# Altium schematic sheet 如意硬件采集模块0831.SchDoc
size A2
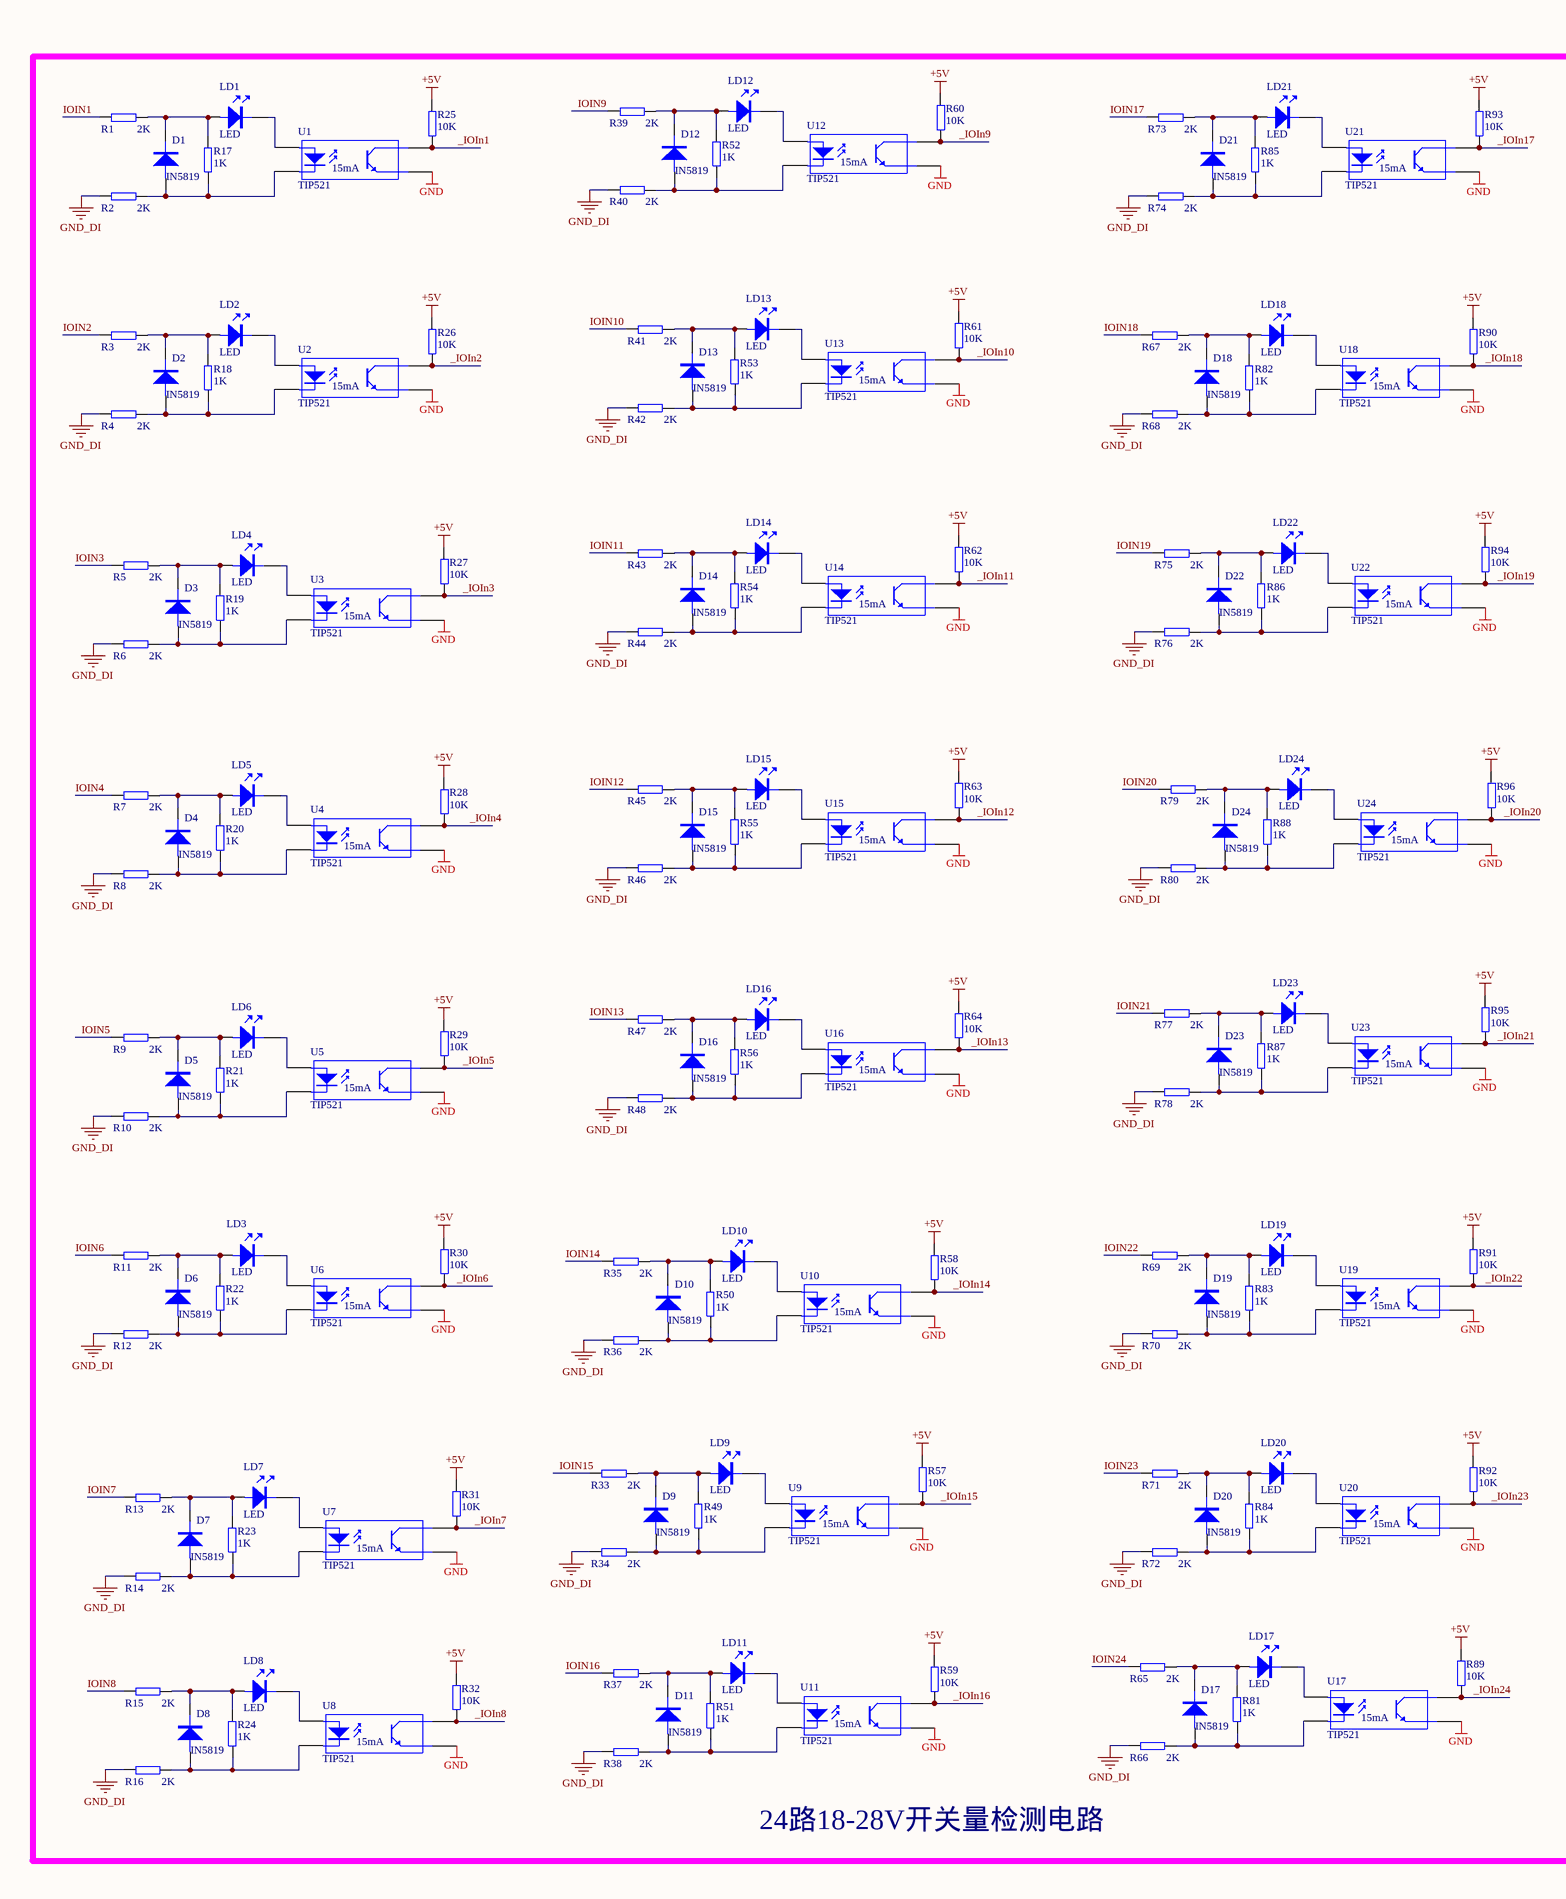
[diagram p0: 如意硬件采集模块0831.SchDoc, left]
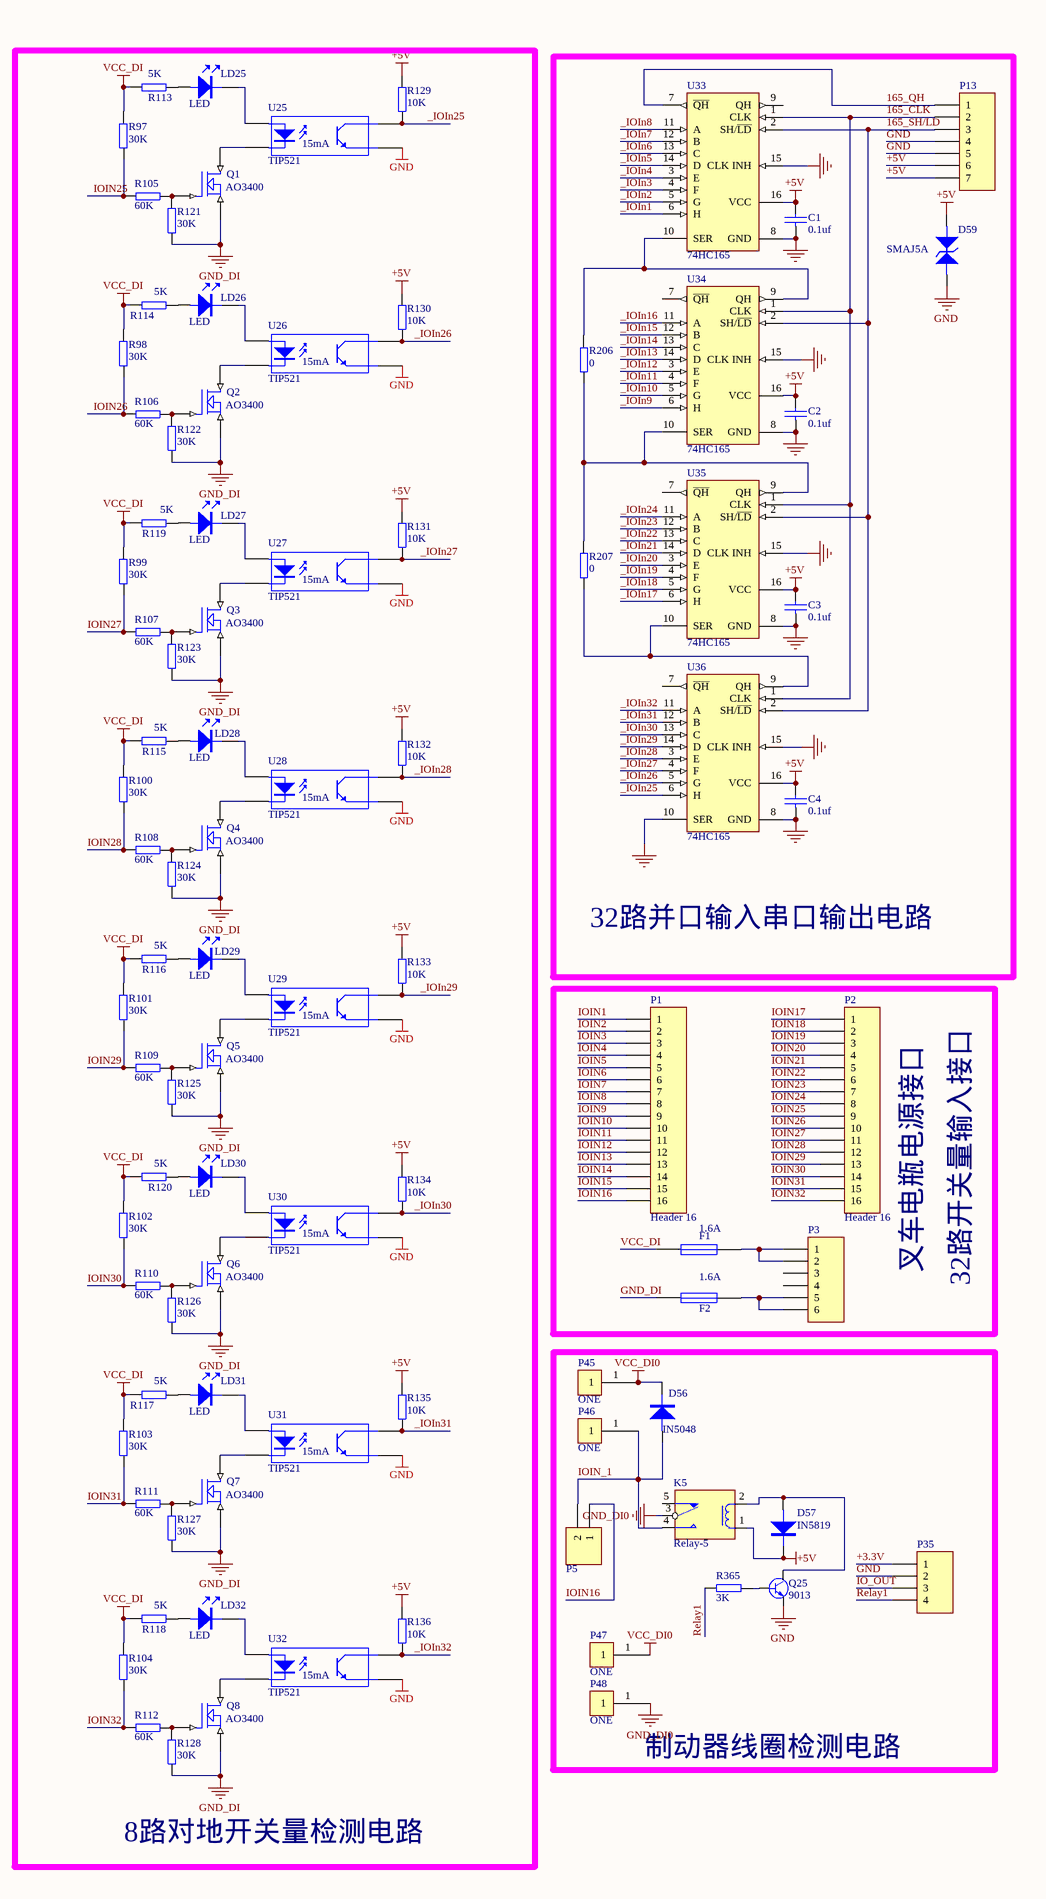
[diagram p1: 如意硬件采集模块0831.SchDoc, right]

## Parts
C1  0.1uf  [0603C-1]
C2  0.1uf  [0603C-1]
C3  0.1uf  [0603C-1]
C4  0.1uf  [0603C-1]
D1  IN5819  [DIODETP-5]
D2  IN5819  [DIODETP-5]
D3  IN5819  [DIODETP-5]
D4  IN5819  [DIODETP-5]
D5  IN5819  [DIODETP-5]
D6  IN5819  [DIODETP-5]
D7  IN5819  [DIODETP-5]
D8  IN5819  [DIODETP-5]
D9  IN5819  [DIODETP-5]
D10  IN5819  [DIODETP-5]
D11  IN5819  [DIODETP-5]
D12  IN5819  [DIODETP-5]
D13  IN5819  [DIODETP-5]
D14  IN5819  [DIODETP-5]
D15  IN5819  [DIODETP-5]
D16  IN5819  [DIODETP-5]
D17  IN5819  [DIODETP-5]
D18  IN5819  [DIODETP-5]
D19  IN5819  [DIODETP-5]
D20  IN5819  [DIODETP-5]
D21  IN5819  [DIODETP-5]
D22  IN5819  [DIODETP-5]
D23  IN5819  [DIODETP-5]
D24  IN5819  [DIODETP-5]
D56  IN5048  [DIODE-AXL]
D57  IN5819  [DIODETP-5]
D59  SMAJ5A  [SMB]
F1  1.6A  [1812]
F2  1.6A  [1812]
K5  Relay-5  [RELAYJL]
LD1  LED  [LED_Z1]
LD2  LED  [LED_Z1]
LD3  LED  [LED_Z1]
LD4  LED  [LED_Z1]
LD5  LED  [LED_Z1]
LD6  LED  [LED_Z1]
LD7  LED  [LED_Z1]
LD8  LED  [LED_Z1]
LD9  LED  [LED_Z1]
LD10  LED  [LED_Z1]
LD11  LED  [LED_Z1]
LD12  LED  [LED_Z1]
LD13  LED  [LED_Z1]
LD14  LED  [LED_Z1]
LD15  LED  [LED_Z1]
LD16  LED  [LED_Z1]
LD17  LED  [LED_Z1]
LD18  LED  [LED_Z1]
LD19  LED  [LED_Z1]
LD20  LED  [LED_Z1]
LD21  LED  [LED_Z1]
LD22  LED  [LED_Z1]
LD23  LED  [LED_Z1]
LD24  LED  [LED_Z1]
LD25  LED  [LED_Z1]
LD26  LED  [LED_Z1]
LD27  LED  [LED_Z1]
LD28  LED  [LED_Z1]
LD29  LED  [LED_Z1]
LD30  LED  [LED_Z1]
LD31  LED  [LED_Z1]
LD32  LED  [LED_Z1]
P1  Header 16  [KF3.96-16P]
P2  Header 16  [KF3.96-16P]
P3  Header 6  [HDR1X6]  (value not drawn)
P5  Header 2  [HDR2X1_A]  (value not drawn)
P13  Header 7  [HDR1X7]  (value not drawn)
P35  Header 4  [HDR1X4]  (value not drawn)
P45  ONE  [ONE]
P46  ONE  [ONE]
P47  ONE  [ONE]
P48  ONE  [ONE]
Q1  AO3400  [SOT23-JFET]
Q2  AO3400  [SOT23-JFET]
Q3  AO3400  [SOT23-JFET]
Q4  AO3400  [SOT23-JFET]
Q5  AO3400  [SOT23-JFET]
Q6  AO3400  [SOT23-JFET]
Q7  AO3400  [SOT23-JFET]
Q8  AO3400  [SOT23-JFET]
Q25  9013  [SOT23-BCE]
R1  2K  [0603R-1]
R2  2K  [0603R-1]
R3  2K  [0603R-1]
R4  2K  [0603R-1]
R5  2K  [0603R-1]
R6  2K  [0603R-1]
R7  2K  [0603R-1]
R8  2K  [0603R-1]
R9  2K  [0603R-1]
R10  2K  [0603R-1]
R11  2K  [0603R-1]
R12  2K  [0603R-1]
R13  2K  [0603R-1]
R14  2K  [0603R-1]
R15  2K  [0603R-1]
R16  2K  [0603R-1]
R17  1K  [0603R-1]
R18  1K  [0603R-1]
R19  1K  [0603R-1]
R20  1K  [0603R-1]
R21  1K  [0603R-1]
R22  1K  [0603R-1]
R23  1K  [0603R-1]
R24  1K  [0603R-1]
R25  10K  [0603R-1]
R26  10K  [0603R-1]
R27  10K  [0603R-1]
R28  10K  [0603R-1]
R29  10K  [0603R-1]
R30  10K  [0603R-1]
R31  10K  [0603R-1]
R32  10K  [0603R-1]
R33  2K  [0603R-1]
R34  2K  [0603R-1]
R35  2K  [0603R-1]
R36  2K  [0603R-1]
R37  2K  [0603R-1]
R38  2K  [0603R-1]
R39  2K  [0603R-1]
R40  2K  [0603R-1]
R41  2K  [0603R-1]
R42  2K  [0603R-1]
R43  2K  [0603R-1]
R44  2K  [0603R-1]
R45  2K  [0603R-1]
R46  2K  [0603R-1]
R47  2K  [0603R-1]
R48  2K  [0603R-1]
R49  1K  [0603R-1]
R50  1K  [0603R-1]
R51  1K  [0603R-1]
R52  1K  [0603R-1]
R53  1K  [0603R-1]
R54  1K  [0603R-1]
R55  1K  [0603R-1]
R56  1K  [0603R-1]
R57  10K  [0603R-1]
R58  10K  [0603R-1]
R59  10K  [0603R-1]
R60  10K  [0603R-1]
R61  10K  [0603R-1]
R62  10K  [0603R-1]
R63  10K  [0603R-1]
R64  10K  [0603R-1]
R65  2K  [0603R-1]
R66  2K  [0603R-1]
R67  2K  [0603R-1]
R68  2K  [0603R-1]
R69  2K  [0603R-1]
R70  2K  [0603R-1]
R71  2K  [0603R-1]
R72  2K  [0603R-1]
R73  2K  [0603R-1]
R74  2K  [0603R-1]
R75  2K  [0603R-1]
R76  2K  [0603R-1]
R77  2K  [0603R-1]
R78  2K  [0603R-1]
R79  2K  [0603R-1]
R80  2K  [0603R-1]
R81  1K  [0603R-1]
R82  1K  [0603R-1]
R83  1K  [0603R-1]
R84  1K  [0603R-1]
R85  1K  [0603R-1]
R86  1K  [0603R-1]
R87  1K  [0603R-1]
R88  1K  [0603R-1]
R89  10K  [0603R-1]
R90  10K  [0603R-1]
R91  10K  [0603R-1]
R92  10K  [0603R-1]
R93  10K  [0603R-1]
R94  10K  [0603R-1]
R95  10K  [0603R-1]
R96  10K  [0603R-1]
R97  30K  [0603R-1]
R98  30K  [0603R-1]
R99  30K  [0603R-1]
R100  30K  [0603R-1]
R101  30K  [0603R-1]
R102  30K  [0603R-1]
R103  30K  [0603R-1]
R104  30K  [0603R-1]
R105  60K  [0603R-1]
R106  60K  [0603R-1]
R107  60K  [0603R-1]
R108  60K  [0603R-1]
R109  60K  [0603R-1]
R110  60K  [0603R-1]
R111  60K  [0603R-1]
R112  60K  [0603R-1]
R113  5K  [0603R-1]
R114  5K  [0603R-1]
R115  5K  [0603R-1]
R116  5K  [0603R-1]
R117  5K  [0603R-1]
R118  5K  [0603R-1]
R119  5K  [0603R-1]
R120  5K  [0603R-1]
R121  30K  [0603R-1]
R122  30K  [0603R-1]
R123  30K  [0603R-1]
R124  30K  [0603R-1]
R125  30K  [0603R-1]
R126  30K  [0603R-1]
R127  30K  [0603R-1]
R128  30K  [0603R-1]
R129  10K  [0603R-1]
R130  10K  [0603R-1]
R131  10K  [0603R-1]
R132  10K  [0603R-1]
R133  10K  [0603R-1]
R134  10K  [0603R-1]
R135  10K  [0603R-1]
R136  10K  [0603R-1]
R206  0  [0603R-1]
R207  0  [0603R-1]
R365  3K  [0603R-1]
U1  TIP521  [DIP-4]
U2  TIP521  [DIP-4]
U3  TIP521  [DIP-4]
U4  TIP521  [DIP-4]
U5  TIP521  [DIP-4]
U6  TIP521  [DIP-4]
U7  TIP521  [DIP-4]
U8  TIP521  [DIP-4]
U9  TIP521  [DIP-4]
U10  TIP521  [DIP-4]
U11  TIP521  [DIP-4]
U12  TIP521  [DIP-4]
U13  TIP521  [DIP-4]
U14  TIP521  [DIP-4]
U15  TIP521  [DIP-4]
U16  TIP521  [DIP-4]
U17  TIP521  [DIP-4]
U18  TIP521  [DIP-4]
U19  TIP521  [DIP-4]
U20  TIP521  [DIP-4]
U21  TIP521  [DIP-4]
U22  TIP521  [DIP-4]
U23  TIP521  [DIP-4]
U24  TIP521  [DIP-4]
U25  TIP521  [DIP-4]
U26  TIP521  [DIP-4]
U27  TIP521  [DIP-4]
U28  TIP521  [DIP-4]
U29  TIP521  [DIP-4]
U30  TIP521  [DIP-4]
U31  TIP521  [DIP-4]
U32  TIP521  [DIP-4]
U33  74HC165  [DIP-16]
U34  74HC165  [DIP-16]
U35  74HC165  [DIP-16]
U36  74HC165  [DIP-16]

## Blocks framed on the sheet
24路18-28V开关量检测电路: D1-D24 LD1-LD24 R1-R96 U1-U24
8路对地开关量检测电路: LD25-LD32 Q1-Q8 R97-R136 U25-U32
32路并口输入串口输出电路: C1-C4 D59 P13 R206 R207 U33-U36
制动器线圈检测电路: D56 D57 K5 P5 P35 P45-P48 Q25 R365

## Nets
+5V: C1.2 C2.2 C3.2 C4.2 D57.2(K) D59.2(K) K5.1 P13.6 P13.7 R25.1 R26.1 R27.1 R28.1 R29.1 R30.1 R31.1 R32.1 R57.1 R58.1 R59.1 R60.1 R61.1 R62.1 R63.1 R64.1 R89.1 R90.1 R91.1 R92.1 R93.1 R94.1 R95.1 R96.1 R129.1 R130.1 R131.1 R132.1 R133.1 R134.1 R135.1 R136.1 U33.16(VCC) U34.16(VCC) U35.16(VCC) U36.16(VCC)
GND: C1.1 C2.1 C3.1 C4.1 D59.1(A) P13.4 P13.5 P35.2 Q25.E U1.3(E) U2.3(E) U3.3(E) U4.3(E) U5.3(E) U6.3(E) U7.3(E) U8.3(E) U9.3(E) U10.3(E) U11.3(E) U12.3(E) U13.3(E) U14.3(E) U15.3(E) U16.3(E) U17.3(E) U18.3(E) U19.3(E) U20.3(E) U21.3(E) U22.3(E) U23.3(E) U24.3(E) U25.3(E) U26.3(E) U27.3(E) U28.3(E) U29.3(E) U30.3(E) U31.3(E) U32.3(E) U33.8(GND) U33.15(CLK_INH) U34.8(GND) U34.15(CLK_INH) U35.8(GND) U35.15(CLK_INH) U36.8(GND) U36.10(SER) U36.15(CLK_INH)
GND_DI: F2.1 Q1.3(S) Q2.3(S) Q3.3(S) Q4.3(S) Q5.3(S) Q6.3(S) Q7.3(S) Q8.3(S) R2.1 R4.1 R6.1 R8.1 R10.1 R12.1 R14.1 R16.1 R34.1 R36.1 R38.1 R40.1 R42.1 R44.1 R46.1 R48.1 R66.1 R68.1 R70.1 R72.1 R74.1 R76.1 R78.1 R80.1 R121.1 R122.1 R123.1 R124.1 R125.1 R126.1 R127.1 R128.1
GND_DI0: K5.3 P48.1
VCC_DI: F1.1 R97.2 R98.2 R99.2 R100.2 R101.2 R102.2 R103.2 R104.2 R113.1 R114.1 R115.1 R116.1 R117.1 R118.1 R119.1 R120.1
VCC_DI0: D56.2(K) P45.1 P47.1
165_CLK: P13.2 U33.1(CLK) U34.1(CLK) U35.1(CLK) U36.1(CLK)
165_QH: P13.1 U33.7(~{QH})
165_SH/LD: P13.3 U33.2(SH/~{LD}) U34.2(SH/~{LD}) U35.2(SH/~{LD}) U36.2(SH/~{LD})
+3.3V: P35.1
_IOIn1: R25.2 U1.4(C) U33.6(H)
_IOIn2: R26.2 U2.4(C) U33.5(G)
_IOIn3: R27.2 U3.4(C) U33.4(F)
_IOIn4: R28.2 U4.4(C) U33.3(E)
_IOIn5: R29.2 U5.4(C) U33.14(D)
_IOIn6: R30.2 U6.4(C) U33.13(C)
_IOIn7: R31.2 U7.4(C) U33.12(B)
_IOIn8: R32.2 U8.4(C) U33.11(A)
_IOIn9: R60.2 U12.4(C) U34.6(H)
_IOIn10: R61.2 U13.4(C) U34.5(G)
_IOIn11: R62.2 U14.4(C) U34.4(F)
_IOIn12: R63.2 U15.4(C) U34.3(E)
_IOIn13: R64.2 U16.4(C) U34.14(D)
_IOIn14: R58.2 U10.4(C) U34.13(C)
_IOIn15: R57.2 U9.4(C) U34.12(B)
_IOIn16: R59.2 U11.4(C) U34.11(A)
_IOIn17: R93.2 U21.4(C) U35.6(H)
_IOIn18: R90.2 U18.4(C) U35.5(G)
_IOIn19: R94.2 U22.4(C) U35.4(F)
_IOIn20: R96.2 U24.4(C) U35.3(E)
_IOIn21: R95.2 U23.4(C) U35.14(D)
_IOIn22: R91.2 U19.4(C) U35.13(C)
_IOIn23: R92.2 U20.4(C) U35.12(B)
_IOIn24: R89.2 U17.4(C) U35.11(A)
_IOIn25: R129.2 U25.4(C) U36.6(H)
_IOIn26: R130.2 U26.4(C) U36.5(G)
_IOIn27: R131.2 U27.4(C) U36.4(F)
_IOIn28: R132.2 U28.4(C) U36.3(E)
_IOIn29: R133.2 U29.4(C) U36.14(D)
_IOIn30: R134.2 U30.4(C) U36.13(C)
_IOIn31: R135.2 U31.4(C) U36.12(B)
_IOIn32: R136.2 U32.4(C) U36.11(A)
IO_OUT: P35.3
IOIN1: P1.1 R1.1
IOIN2: P1.2 R3.1
IOIN3: P1.3 R5.1
IOIN4: P1.4 R7.1
IOIN5: P1.5 R9.1
IOIN6: P1.6 R11.1
IOIN7: P1.7 R13.1
IOIN8: P1.8 R15.1
IOIN9: P1.9 R39.1
IOIN10: P1.10 R41.1
IOIN11: P1.11 R43.1
IOIN12: P1.12 R45.1
IOIN13: P1.13 R47.1
IOIN14: P1.14 R35.1
IOIN15: P1.15 R33.1
IOIN16: P1.16 P5.1 R37.1
IOIN17: P2.1 R73.1
IOIN18: P2.2 R67.1
IOIN19: P2.3 R75.1
IOIN20: P2.4 R79.1
IOIN21: P2.5 R77.1
IOIN22: P2.6 R69.1
IOIN23: P2.7 R71.1
IOIN24: P2.8 R65.1
IOIN25: P2.9 R97.1 R105.1
IOIN26: P2.10 R98.1 R106.1
IOIN27: P2.11 R99.1 R107.1
IOIN28: P2.12 R100.1 R108.1
IOIN29: P2.13 R101.1 R109.1
IOIN30: P2.14 R102.1 R110.1
IOIN31: P2.15 R103.1 R111.1
IOIN32: P2.16 R104.1 R112.1
IOIN_1: D56.1(A) K5.4 P5.2 P46.1
Relay1: P35.4 R365.2
NetD1_1: D1.1(A) R2.2 R17.1 U1.2(K)
NetD1_2: D1.2(K) LD1.1 R1.2 R17.2
NetD2_1: D2.1(A) R4.2 R18.1 U2.2(K)
NetD2_2: D2.2(K) LD2.1 R3.2 R18.2
NetD3_1: D3.1(A) R6.2 R19.1 U3.2(K)
NetD3_2: D3.2(K) LD4.1 R5.2 R19.2
NetD4_1: D4.1(A) R8.2 R20.1 U4.2(K)
NetD4_2: D4.2(K) LD5.1 R7.2 R20.2
NetD5_1: D5.1(A) R10.2 R21.1 U5.2(K)
NetD5_2: D5.2(K) LD6.1 R9.2 R21.2
NetD6_1: D6.1(A) R12.2 R22.1 U6.2(K)
NetD6_2: D6.2(K) LD3.1 R11.2 R22.2
NetD7_1: D7.1(A) R14.2 R23.1 U7.2(K)
NetD7_2: D7.2(K) LD7.1 R13.2 R23.2
NetD8_1: D8.1(A) R16.2 R24.1 U8.2(K)
NetD8_2: D8.2(K) LD8.1 R15.2 R24.2
NetD9_1: D9.1(A) R34.2 R49.1 U9.2(K)
NetD9_2: D9.2(K) LD9.1 R33.2 R49.2
NetD10_1: D10.1(A) R36.2 R50.1 U10.2(K)
NetD10_2: D10.2(K) LD10.1 R35.2 R50.2
NetD11_1: D11.1(A) R38.2 R51.1 U11.2(K)
NetD11_2: D11.2(K) LD11.1 R37.2 R51.2
NetD12_1: D12.1(A) R40.2 R52.1 U12.2(K)
NetD12_2: D12.2(K) LD12.1 R39.2 R52.2
NetD13_1: D13.1(A) R42.2 R53.1 U13.2(K)
NetD13_2: D13.2(K) LD13.1 R41.2 R53.2
NetD14_1: D14.1(A) R44.2 R54.1 U14.2(K)
NetD14_2: D14.2(K) LD14.1 R43.2 R54.2
NetD15_1: D15.1(A) R46.2 R55.1 U15.2(K)
NetD15_2: D15.2(K) LD15.1 R45.2 R55.2
NetD16_1: D16.1(A) R48.2 R56.1 U16.2(K)
NetD16_2: D16.2(K) LD16.1 R47.2 R56.2
NetD17_1: D17.1(A) R66.2 R81.1 U17.2(K)
NetD17_2: D17.2(K) LD17.1 R65.2 R81.2
NetD18_1: D18.1(A) R68.2 R82.1 U18.2(K)
NetD18_2: D18.2(K) LD18.1 R67.2 R82.2
NetD19_1: D19.1(A) R70.2 R83.1 U19.2(K)
NetD19_2: D19.2(K) LD19.1 R69.2 R83.2
NetD20_1: D20.1(A) R72.2 R84.1 U20.2(K)
NetD20_2: D20.2(K) LD20.1 R71.2 R84.2
NetD21_1: D21.1(A) R74.2 R85.1 U21.2(K)
NetD21_2: D21.2(K) LD21.1 R73.2 R85.2
NetD22_1: D22.1(A) R76.2 R86.1 U22.2(K)
NetD22_2: D22.2(K) LD22.1 R75.2 R86.2
NetD23_1: D23.1(A) R78.2 R87.1 U23.2(K)
NetD23_2: D23.2(K) LD23.1 R77.2 R87.2
NetD24_1: D24.1(A) R80.2 R88.1 U24.2(K)
NetD24_2: D24.2(K) LD24.1 R79.2 R88.2
NetD57_1: D57.1(A) K5.2 Q25.C
NetF1_2: F1.2 P3.1 P3.2
NetF2_2: F2.2 P3.5 P3.6
NetLD1_2: LD1.2 U1.1(A)
NetLD2_2: LD2.2 U2.1(A)
NetLD3_2: LD3.2 U6.1(A)
NetLD4_2: LD4.2 U3.1(A)
NetLD5_2: LD5.2 U4.1(A)
NetLD6_2: LD6.2 U5.1(A)
NetLD7_2: LD7.2 U7.1(A)
NetLD8_2: LD8.2 U8.1(A)
NetLD9_2: LD9.2 U9.1(A)
NetLD10_2: LD10.2 U10.1(A)
NetLD11_2: LD11.2 U11.1(A)
NetLD12_2: LD12.2 U12.1(A)
NetLD13_2: LD13.2 U13.1(A)
NetLD14_2: LD14.2 U14.1(A)
NetLD15_2: LD15.2 U15.1(A)
NetLD16_2: LD16.2 U16.1(A)
NetLD17_2: LD17.2 U17.1(A)
NetLD18_2: LD18.2 U18.1(A)
NetLD19_2: LD19.2 U19.1(A)
NetLD20_2: LD20.2 U20.1(A)
NetLD21_2: LD21.2 U21.1(A)
NetLD22_2: LD22.2 U22.1(A)
NetLD23_2: LD23.2 U23.1(A)
NetLD24_2: LD24.2 U24.1(A)
NetLD25_1: LD25.1 R113.2
NetLD25_2: LD25.2 U25.1(A)
NetLD26_1: LD26.1 R114.2
NetLD26_2: LD26.2 U26.1(A)
NetLD27_1: LD27.1 R119.2
NetLD27_2: LD27.2 U27.1(A)
NetLD28_1: LD28.1 R115.2
NetLD28_2: LD28.2 U28.1(A)
NetLD29_1: LD29.1 R116.2
NetLD29_2: LD29.2 U29.1(A)
NetLD30_1: LD30.1 R120.2
NetLD30_2: LD30.2 U30.1(A)
NetLD31_1: LD31.1 R117.2
NetLD31_2: LD31.2 U31.1(A)
NetLD32_1: LD32.1 R118.2
NetLD32_2: LD32.2 U32.1(A)
NetQ1_1: Q1.1(G) R105.2 R121.2
NetQ1_2: Q1.2(D) U25.2(K)
NetQ2_1: Q2.1(G) R106.2 R122.2
NetQ2_2: Q2.2(D) U26.2(K)
NetQ3_1: Q3.1(G) R107.2 R123.2
NetQ3_2: Q3.2(D) U27.2(K)
NetQ4_1: Q4.1(G) R108.2 R124.2
NetQ4_2: Q4.2(D) U28.2(K)
NetQ5_1: Q5.1(G) R109.2 R125.2
NetQ5_2: Q5.2(D) U29.2(K)
NetQ6_1: Q6.1(G) R110.2 R126.2
NetQ6_2: Q6.2(D) U30.2(K)
NetQ7_1: Q7.1(G) R111.2 R127.2
NetQ7_2: Q7.2(D) U31.2(K)
NetQ8_1: Q8.1(G) R112.2 R128.2
NetQ8_2: Q8.2(D) U32.2(K)
NetQ25_B: Q25.B R365.1
NetR206_1: R206.1 U33.10(SER) U34.9(QH)
NetR206_2: R206.2 R207.1 U34.10(SER) U35.9(QH)
NetR207_2: R207.2 U35.10(SER) U36.9(QH)

Not connected (* = marked no-connect by the designer): K5 5; P3 3 4; U33 9(QH); U34 7(~{QH}); U35 7(~{QH}); U36 7(~{QH})

## Notes on the sheet
- (near U1) 15mA
- (near U12) 15mA
- (near U21) 15mA
- (near U25) 15mA
- (near U26) 15mA
- (near U2) 15mA
- (near U13) 15mA
- (near U18) 15mA
- (near U14) 15mA
- (near U22) 15mA
- (near U27) 15mA
- (near U3) 15mA
- (near U4) 15mA
- (near U15) 15mA
- (near U24) 15mA
- (near U28) 15mA
- (near U29) 15mA
- (near U5) 15mA
- (near U16) 15mA
- (near U23) 15mA
- (near U30) 15mA
- 叉车电瓶电源接口
- (near U6) 15mA
- (near U10) 15mA
- (near U19) 15mA
- 32路开关量输入接口
- (near U31) 15mA
- (near U7) 15mA
- (near U9) 15mA
- (near U20) 15mA
- (near U32) 15mA
- (near U8) 15mA
- (near U11) 15mA
- (near U17) 15mA

## Library data of the parts
C1-C4 = CAP: Capacitor
D1-D24 D56 D57 = DIODE
D59 = TVS
F1 F2 = FUSE1: Fuse
P1 P2 = Header 16: Header16贴片; LatestRevisionDate: 17-Jul-2002; LatestRevisionNote: Re-released for DXP Platform.; Publisher: Altium Limited
P3 = Header 6: Header, 6-Pin; LatestRevisionDate: 17-Jul-2002; LatestRevisionNote: Re-released for DXP Platform.; Publisher: Altium Limited
P5 = Header 2: 接插件; LatestRevisionDate: 17-Jul-2002; LatestRevisionNote: Re-released for DXP Platform.; Publisher: Altium Limited
P13 = Header 7: Header, 7-Pin; LatestRevisionDate: 17-Jul-2002; LatestRevisionNote: Re-released for DXP Platform.; Publisher: Altium Limited
P35 = Header 4: Header, 4-Pin; LatestRevisionDate: 17-Jul-2002; LatestRevisionNote: Re-released for DXP Platform.; Publisher: Altium Limited
Q1-Q8 = MOSFET N
Q25 = NPN
R1-R104 R113-R120 R129-R136 R206 R207 = RES2
R105-R112 R121-R128 R365 = RES-2
U1-U32 = OPTOISO1: Optoisolator
U33-U36 = 74HC165: 8并口输入，串口输出; Published: 17-Jul-2002; LatestRevisionDate: 13-Apr-2006; LatestRevisionNote: IPC-7351 Footprint Added.; DatasheetVersion: Nov-1999; PackageVersion: 2000; PackageReference: M16D; Publisher: Altium Limited; PackageDescription: 16-Pin Small Outline Package 1.27 mm Pitch; ComponentLink1Description: Manufacturer Link; ComponentLink1URL: http://www.fairchildsemi.com/; ComponentLink2Description: Datasheet; ComponentLink2URL: http://www.fairchildsemi.com/ds/74%2F74AC138.pdf